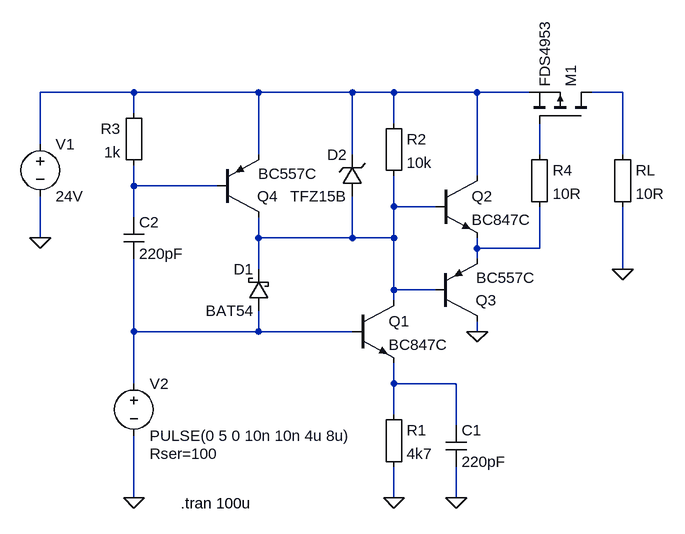
[diagram p0: schematic P-channel MOSFET shift_5.asc]
P-channel MOSFET shift_5.asc, the LTspice schematic file:
Version 4
SHEET 1 1044 680
WIRE -256 -96 -400 -96
WIRE -64 -96 -256 -96
WIRE 80 -96 -64 -96
WIRE 144 -96 80 -96
WIRE 272 -96 144 -96
WIRE 352 -96 272 -96
WIRE 496 -96 448 -96
WIRE -256 -64 -256 -96
WIRE 144 -48 144 -96
WIRE -400 -16 -400 -96
WIRE -64 0 -64 -96
WIRE 80 0 80 -96
WIRE 368 0 368 -48
WIRE 496 0 496 -96
WIRE 272 32 272 -96
WIRE -256 48 -256 16
WIRE -128 48 -256 48
WIRE 144 80 144 32
WIRE 208 80 144 80
WIRE -256 96 -256 48
WIRE -400 128 -400 64
WIRE -64 128 -64 96
WIRE 80 128 80 64
WIRE 80 128 -64 128
WIRE 144 128 144 80
WIRE 144 128 80 128
WIRE 272 144 272 128
WIRE 368 144 368 80
WIRE 368 144 272 144
WIRE 272 160 272 144
WIRE -64 176 -64 128
WIRE 496 176 496 80
WIRE 144 208 144 128
WIRE 208 208 144 208
WIRE 144 224 144 208
WIRE -256 272 -256 160
WIRE -64 272 -64 240
WIRE -64 272 -256 272
WIRE 80 272 -64 272
WIRE 272 272 272 256
WIRE -256 352 -256 272
WIRE 144 352 144 320
WIRE 240 352 144 352
WIRE 144 400 144 352
WIRE 240 416 240 352
WIRE -256 528 -256 432
WIRE 144 528 144 480
WIRE 240 528 240 480
FLAG -400 128 0
FLAG 496 176 0
FLAG -256 528 0
FLAG 144 528 0
FLAG 240 528 0
FLAG 272 272 0
SYMBOL npn 208 32 R0
SYMATTR InstName Q2
SYMATTR Value BC847C
SYMBOL Misc\\EuropeanResistor 128 384 R0
SYMATTR InstName R1
SYMATTR Value 4k7
SYMBOL voltage -400 -32 R0
WINDOW 123 0 0 Left 2
WINDOW 39 0 0 Left 2
SYMATTR InstName V1
SYMATTR Value 24V
SYMBOL pmos 448 -48 M270
SYMATTR InstName M1
SYMATTR Value FDS4953
SYMBOL Misc\\EuropeanResistor 480 -16 R0
SYMATTR InstName RL
SYMATTR Value 10R
SYMBOL voltage -256 336 R0
WINDOW 123 0 0 Left 2
WINDOW 39 24 124 Left 2
SYMATTR SpiceLine Rser=100
SYMATTR InstName V2
SYMATTR Value PULSE(0 5 0 10n 10n 4u 8u)
SYMBOL npn 80 224 R0
SYMATTR InstName Q1
SYMATTR Value BC847C
SYMBOL pnp -128 96 M180
WINDOW 0 62 32 Left 2
WINDOW 3 63 67 Left 2
SYMATTR InstName Q4
SYMATTR Value BC557C
SYMBOL Misc\\EuropeanResistor -240 -80 M0
SYMATTR InstName R3
SYMATTR Value 1k
SYMBOL cap -272 96 R0
SYMATTR InstName C2
SYMATTR Value 220pF
SYMBOL cap 224 416 R0
SYMATTR InstName C1
SYMATTR Value 220pF
SYMBOL pnp 208 256 M180
WINDOW 0 62 32 Left 2
WINDOW 3 63 67 Left 2
SYMATTR InstName Q3
SYMATTR Value BC557C
SYMBOL Misc\\EuropeanResistor 128 -64 R0
SYMATTR InstName R2
SYMATTR Value 10k
SYMBOL Misc\\EuropeanResistor 352 -16 R0
SYMATTR InstName R4
SYMATTR Value 10R
SYMBOL schottky -48 240 R180
WINDOW 0 24 64 Left 2
WINDOW 3 24 0 Left 2
SYMATTR InstName D1
SYMATTR Value BAT54
SYMATTR Description Diode
SYMATTR Type diode
SYMBOL zener 96 64 R180
WINDOW 0 24 64 Left 2
WINDOW 3 24 0 Left 2
SYMATTR InstName D2
SYMATTR Value TFZ15B
SYMATTR Description Diode
SYMATTR Type diode
TEXT -184 536 Left 2 !.tran 100u

The netlist it stands for:
* P-channel MOSFET shift_5.asc
Q2 N001 N005 N006 0 BC847C
R1 N008 0 4k7
V1 N001 0 24V
M1 N002 N003 N001 N001 FDS4953
RL N002 0 10R
V2 N007 0 PULSE(0 5 0 10n 10n 4u 8u) Rser=100
Q1 N005 N007 N008 0 BC847C
Q4 N005 N004 N001 0 BC557C
R3 N001 N004 1k
C2 N004 N007 220pF
C1 N008 0 220pF
Q3 0 N005 N006 0 BC557C
R2 N001 N005 10k
R4 N003 N006 10R
D1 N007 N005 BAT54
D2 N005 N001 TFZ15B
.model D D
.lib standard.dio
.model NPN NPN
.model PNP PNP
.lib standard.bjt
.model NMOS NMOS
.model PMOS PMOS
.lib standard.mos
.tran 100u
.backanno
.end